# EasyEDA schematic GyroCube_easyeda.json
TITLE: Sheet_1; REV: 1.0; Date: 2021-03-06; Sheet: 1/1; Drawn By: Sergej Herbert; Company: Your Company
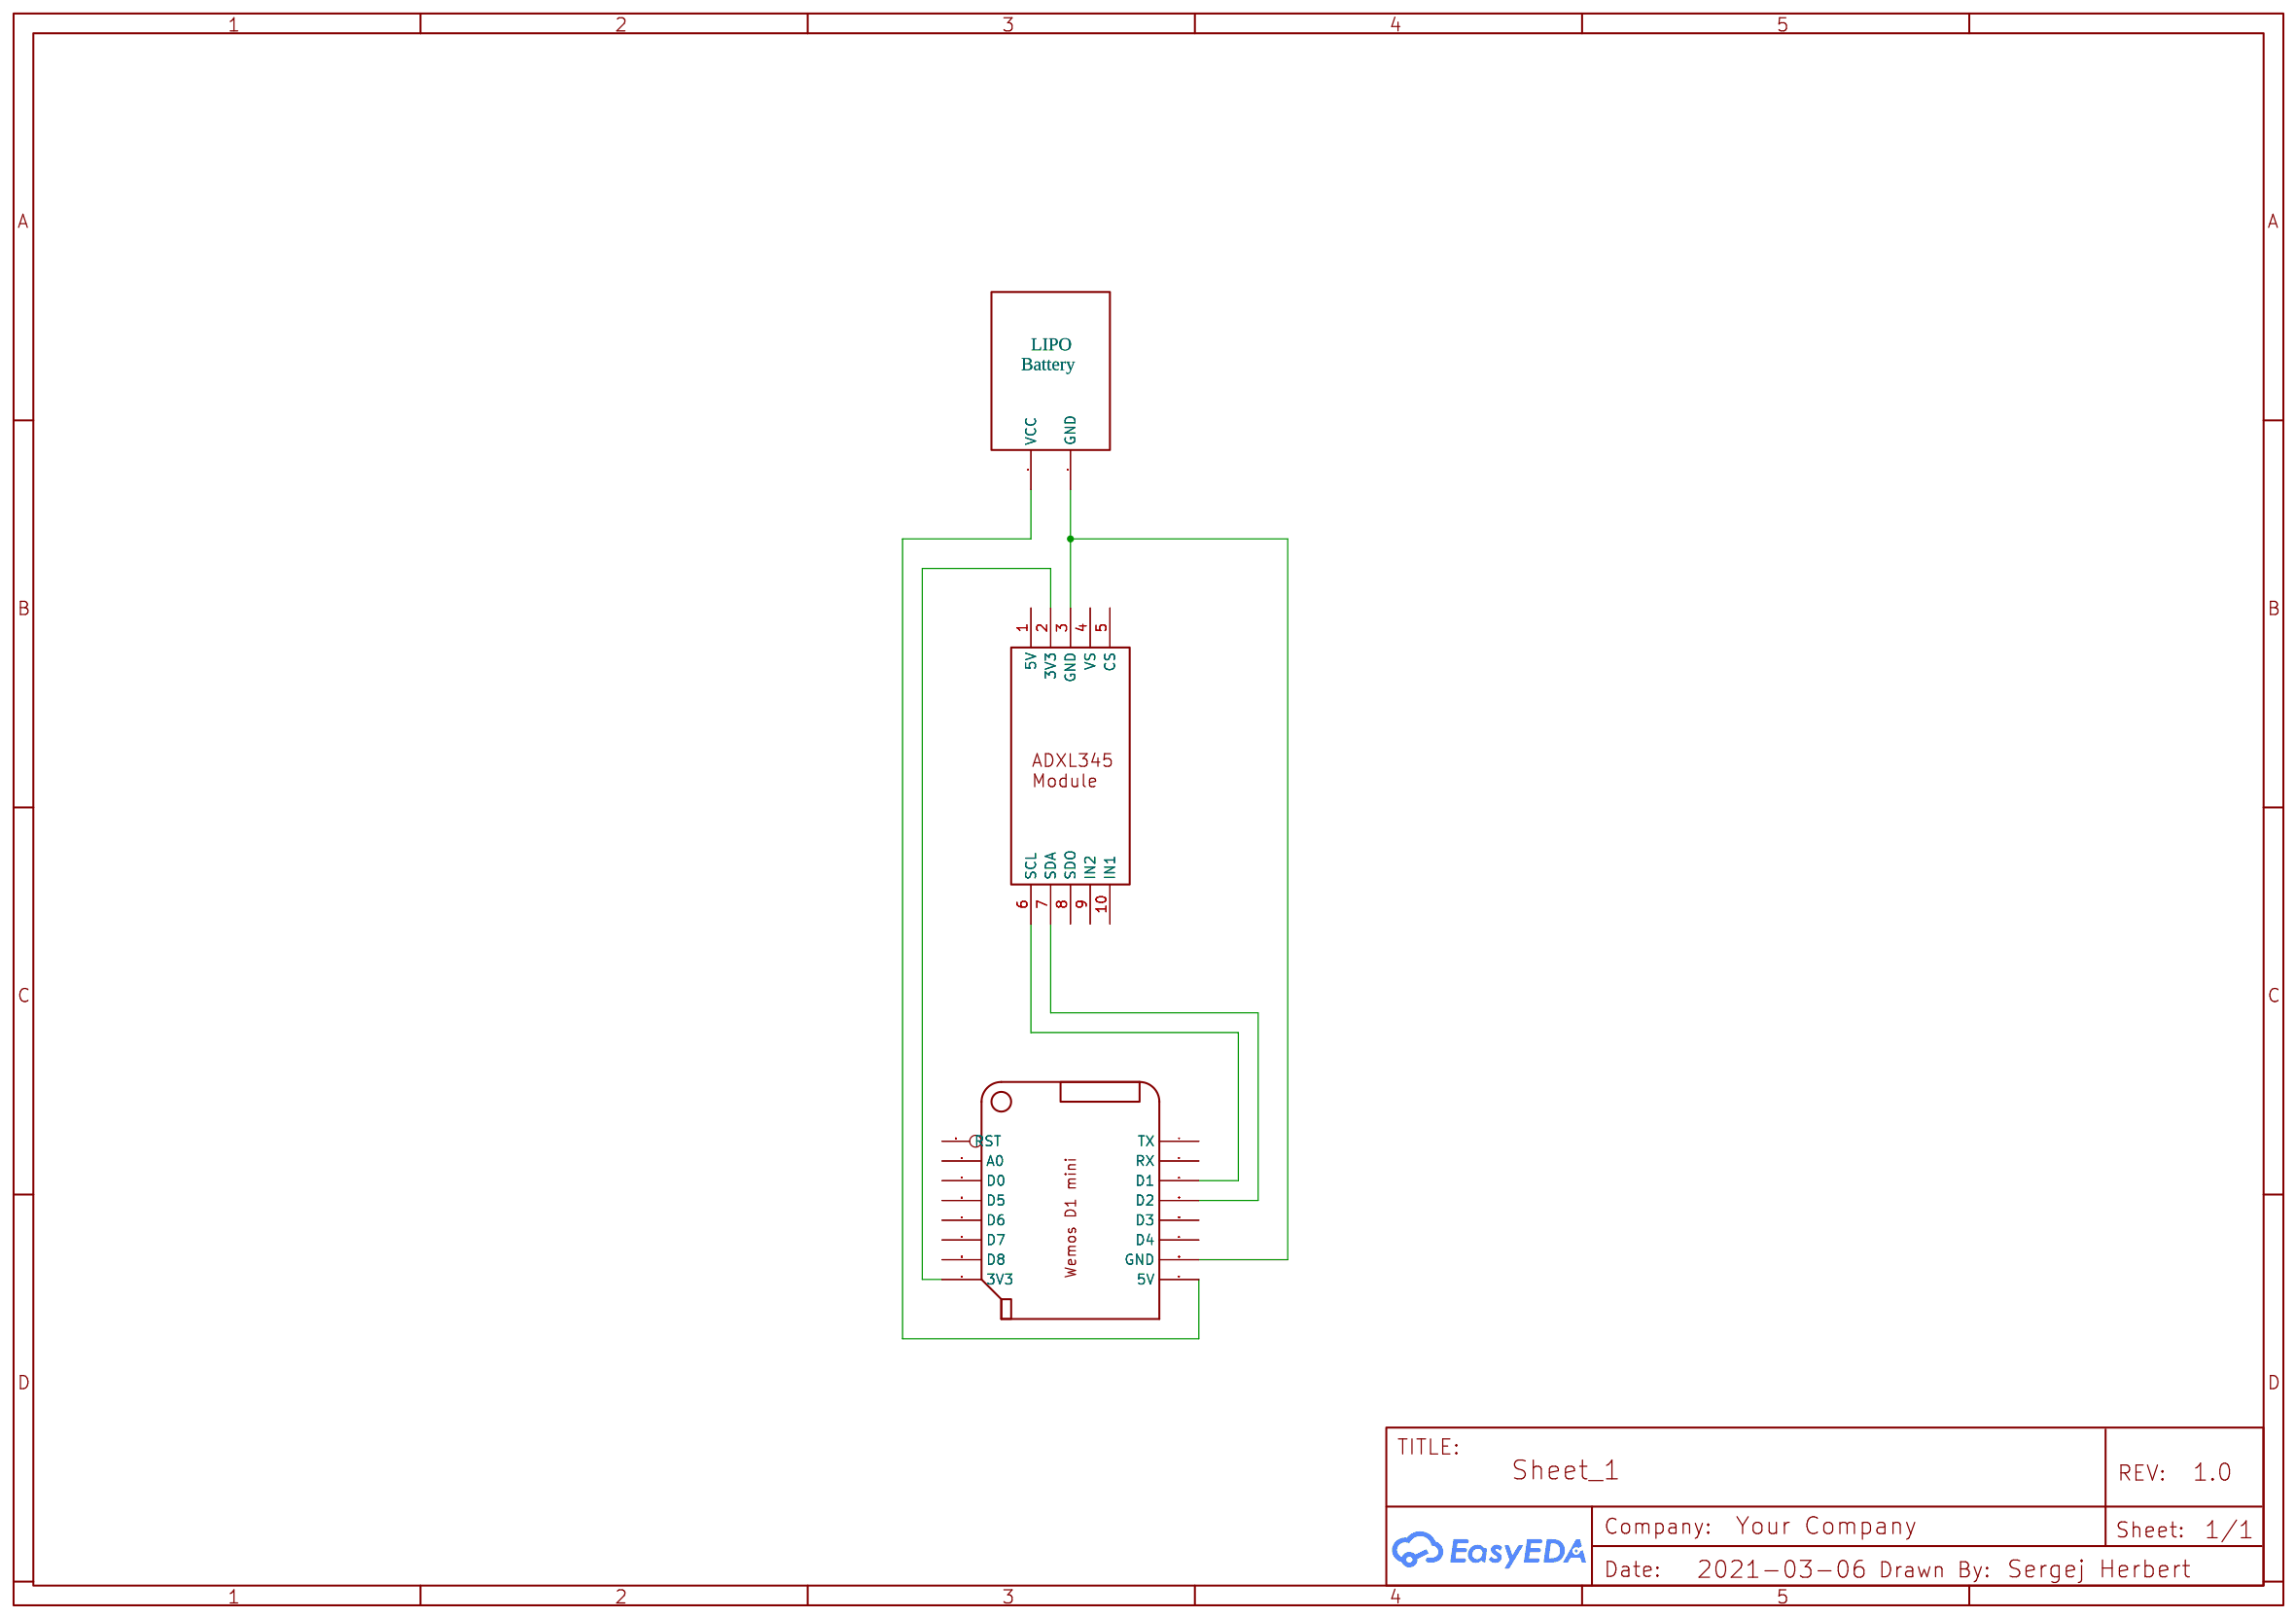
[diagram p0: schematic sheet]

## Parts
LIPO  Battery
U2  ADXL345  [ADXL345 MODULE]
U3  Wemos D1

## Library data of the parts
U2 = ADXL345: Manufacturer: Ebay; link: https://www.ebay.com/itm/3-Axis-ADXL345-Digital-Acceleration-of-Gravity-Tilt-Module-AVR-ARM-MCU-Arduino/173736766751?ssPageName=STRK%3AMEBIDX%3AIT&_trksid=p2057872.m2749.l2649; Contributor: matti.vilska
U3 = Wemos D1: Supplier: LCSC; Contributor: Steve Archibald

## Nets
Net-(LIPO-1): LIPO.1(VCC) U3.5V
Net-(LIPO-2): LIPO.2(GND) U2.3(GND) U3.GND
Net-(U2-2): U2.2(3V3) U3.3V3
Net-(U2-6): U2.6(SCL) U3.D1
Net-(U2-7): U2.7(SDA) U3.D2

Not connected (* = marked no-connect by the designer): U2 1(5V) 4(VS) 5(CS) 8(SDO) 9(IN2) 10(IN1); U3 A0 D0 D3 D4 D5 D6 D7 D8 RST RX TX
